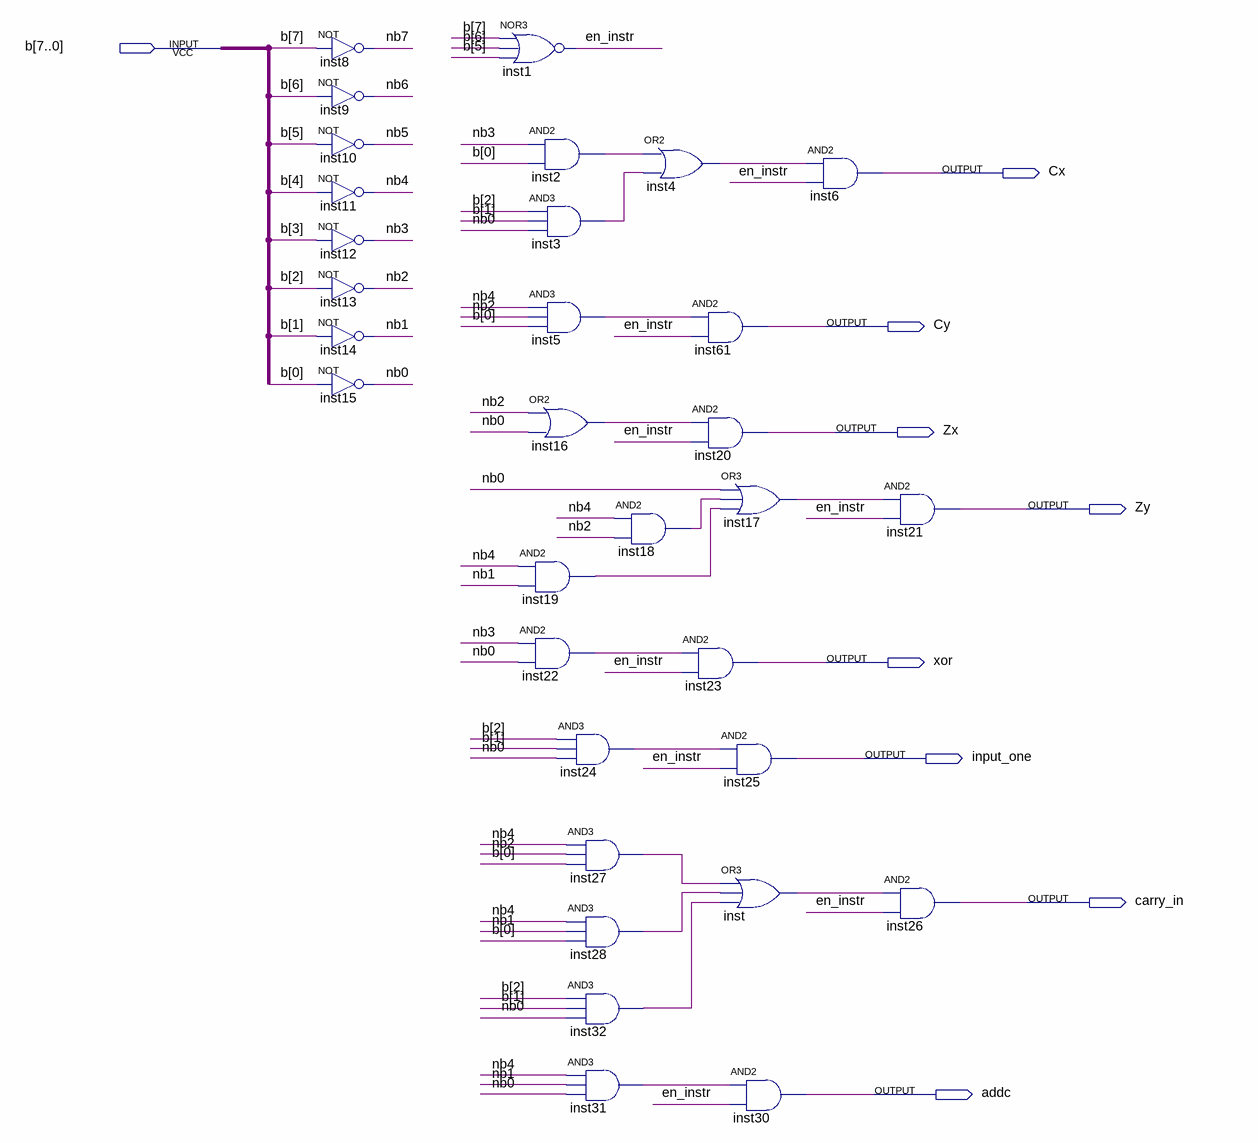
[diagram p0: schematic sheet]
// Quartus schematic decoderULA.bdf as structural Verilog: 32 symbols, 9 pins
module decoderULA (
  input  [7:0] b,
  output Cx,
  output Cy,
  output Zx,
  output Zy,
  output \xor ,
  output input_one,
  output carry_in,
  output addc
);

  wire en_instr, inst2_out, inst3_out, inst4_out, inst5_out, inst16_out, inst17_out, inst18_out, inst19_out,
       inst22_out, inst24_out, inst27_out, inst28_out, inst31_out, inst32_out, inst_out, nb0, nb1, nb2, nb3,
       nb4, nb5, nb6, nb7;

  not inst8 (nb7, b[7]);
  not inst9 (nb6, b[6]);
  not inst10 (nb5, b[5]);
  not inst11 (nb4, b[4]);
  not inst12 (nb3, b[3]);
  not inst13 (nb2, b[2]);
  not inst14 (nb1, b[1]);
  not inst15 (nb0, b[0]);
  nor inst1 (en_instr, b[7], b[6], b[5]);
  and inst2 (inst2_out, nb3, b[0]);
  and inst3 (inst3_out, b[2], b[1], nb0);
  and inst5 (inst5_out, nb4, nb2, b[0]);
  or inst16 (inst16_out, nb2, nb0);
  and inst19 (inst19_out, nb4, nb1);
  and inst22 (inst22_out, nb3, nb0);
  and inst24 (inst24_out, b[2], b[1], nb0);
  and inst27 (inst27_out, nb4, nb2, b[0]);
  and inst28 (inst28_out, nb4, nb1, b[0]);
  and inst32 (inst32_out, b[2], b[1], nb0);
  and inst31 (inst31_out, nb4, nb1, nb0);
  or inst4 (inst4_out, inst2_out, inst3_out);
  and inst18 (inst18_out, nb4, nb2);
  and inst23 (\xor , inst22_out, en_instr);
  and inst61 (Cy, inst5_out, en_instr);
  and inst20 (Zx, inst16_out, en_instr);
  or inst17 (inst17_out, nb0, inst18_out, inst19_out);
  and inst25 (input_one, inst24_out, en_instr);
  or inst (inst_out, inst27_out, inst28_out, inst32_out);
  and inst30 (addc, inst31_out, en_instr);
  and inst6 (Cx, inst4_out, en_instr);
  and inst21 (Zy, inst17_out, en_instr);
  and inst26 (carry_in, inst_out, en_instr);
endmodule
